# Altium schematic sheet Motors-Encoders.SchDoc
size A4; SheetNumber: 6; SheetTotal: 13
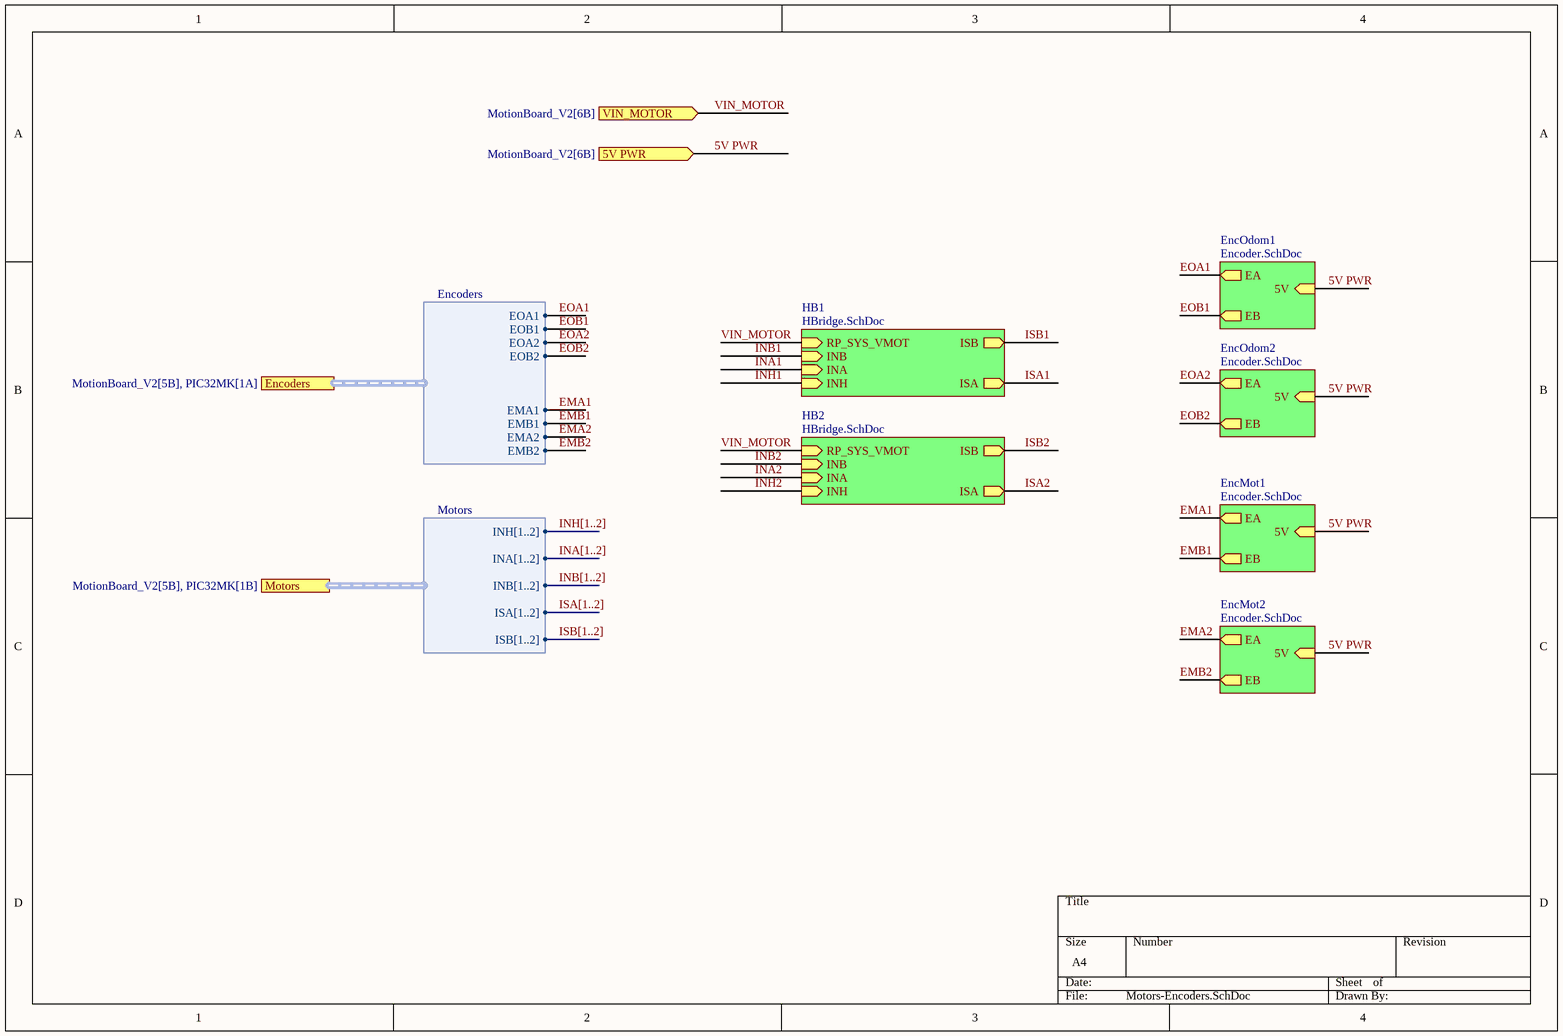
[diagram p0: Motors-Encoders.SchDoc]

## Sub-sheets
EncMot1 = Encoder.SchDoc: EB (out), EA (out), 5V (in)
EncMot2 = Encoder.SchDoc: EB (out), EA (out), 5V (in)
EncOdom1 = Encoder.SchDoc: EB (out), EA (out), 5V (in)
EncOdom2 = Encoder.SchDoc: EB (out), EA (out), 5V (in)
HB1 = HBridge.SchDoc: RP_SYS_VMOT (in), INB (in), ISB (out), ISA (out), INA (in), INH (in)
HB2 = HBridge.SchDoc: RP_SYS_VMOT (in), INB (in), ISB (out), ISA (out), INA (in), INH (in)

## Ports
5V PWR (in, see MotionBoard_V2[6B]), Encoders (harness Encoders, see MotionBoard_V2[5B], PIC32MK[1A]), Motors (harness Motors, see MotionBoard_V2[5B], PIC32MK[1B]), VIN_MOTOR (in, see MotionBoard_V2[6B])

## Harnesses
Encoders: EOA1, EOB1, EOA2, EOB2, EMA1, EMB1, EMA2, EMB2
Motors: INH[1..2], INA[1..2], INB[1..2], ISA[1..2], ISB[1..2]

## Nets
5V PWR: port 5V PWR, sheet EncOdom2/5V, sheet EncMot1/5V, sheet EncOdom1/5V, sheet EncMot2/5V
EMA1: sheet EncMot1/EA, port Encoders.EMA1
EMA2: sheet EncMot2/EA, port Encoders.EMA2
EMB1: sheet EncMot1/EB, port Encoders.EMB1
EMB2: sheet EncMot2/EB, port Encoders.EMB2
EOA1: sheet EncOdom1/EA, port Encoders.EOA1
EOA2: sheet EncOdom2/EA, port Encoders.EOA2
EOB1: sheet EncOdom1/EB, port Encoders.EOB1
EOB2: sheet EncOdom2/EB, port Encoders.EOB2
INA1: sheet HB1/INA
INA2: sheet HB2/INA
INB1: sheet HB1/INB
INB2: sheet HB2/INB
INH1: sheet HB1/INH
INH2: sheet HB2/INH
ISA1: sheet HB1/ISA
ISA2: sheet HB2/ISA
ISB1: sheet HB1/ISB
ISB2: sheet HB2/ISB
VIN_MOTOR: port VIN_MOTOR, sheet HB1/RP_SYS_VMOT, sheet HB2/RP_SYS_VMOT

## Buses and harness runs
bus INA[1..2]
bus INB[1..2]
bus INH[1..2]
bus ISA[1..2]
bus ISB[1..2]